# Altium schematic sheet Antanna.SchDoc
size A4
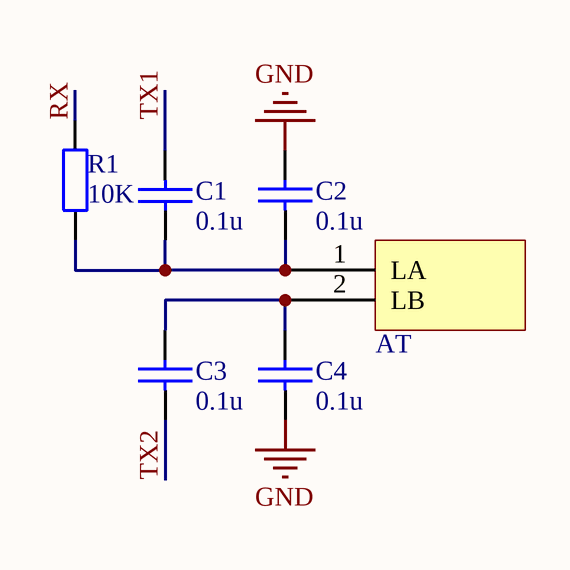
[diagram p0: Antanna.SchDoc]

## Parts
AT  Antanna13M56  (value not drawn)
C1  0.1u  [C0603]
C2  0.1u  [C0603]
C3  0.1u  [C0603]
C4  0.1u  [C0603]
R1  10K  [R0603]

## Nets
GND: C2.1 C4.2
RX: R1.1
TX1: C1.2
TX2: C3.2
NetAT_1: AT.1(LA) C1.1 C2.2 R1.2
NetAT_2: AT.2(LB) C3.1 C4.1

## Library data of the parts
C1-C4 = CAP: Part Field 1: CAP X7R 100NF 10% 50V 0805; Part Field 2: AAPL; Part Field 3: 8124-10446-12
R1 = R: Value: 1K; Published: 8-Jun-2000; LatestRevisionDate: 17-Jul-2002; LatestRevisionNote: Re-released for DXP Platform.; PackageReference: AXIAL-0.4; Publisher: Altium Limited; PackageDescription: Axial Device, Thru-Hole; 2 Leads; 0.4 in Pin Spacing